# EAGLE schematic 2hz timer (EAGLE 9.6.2)
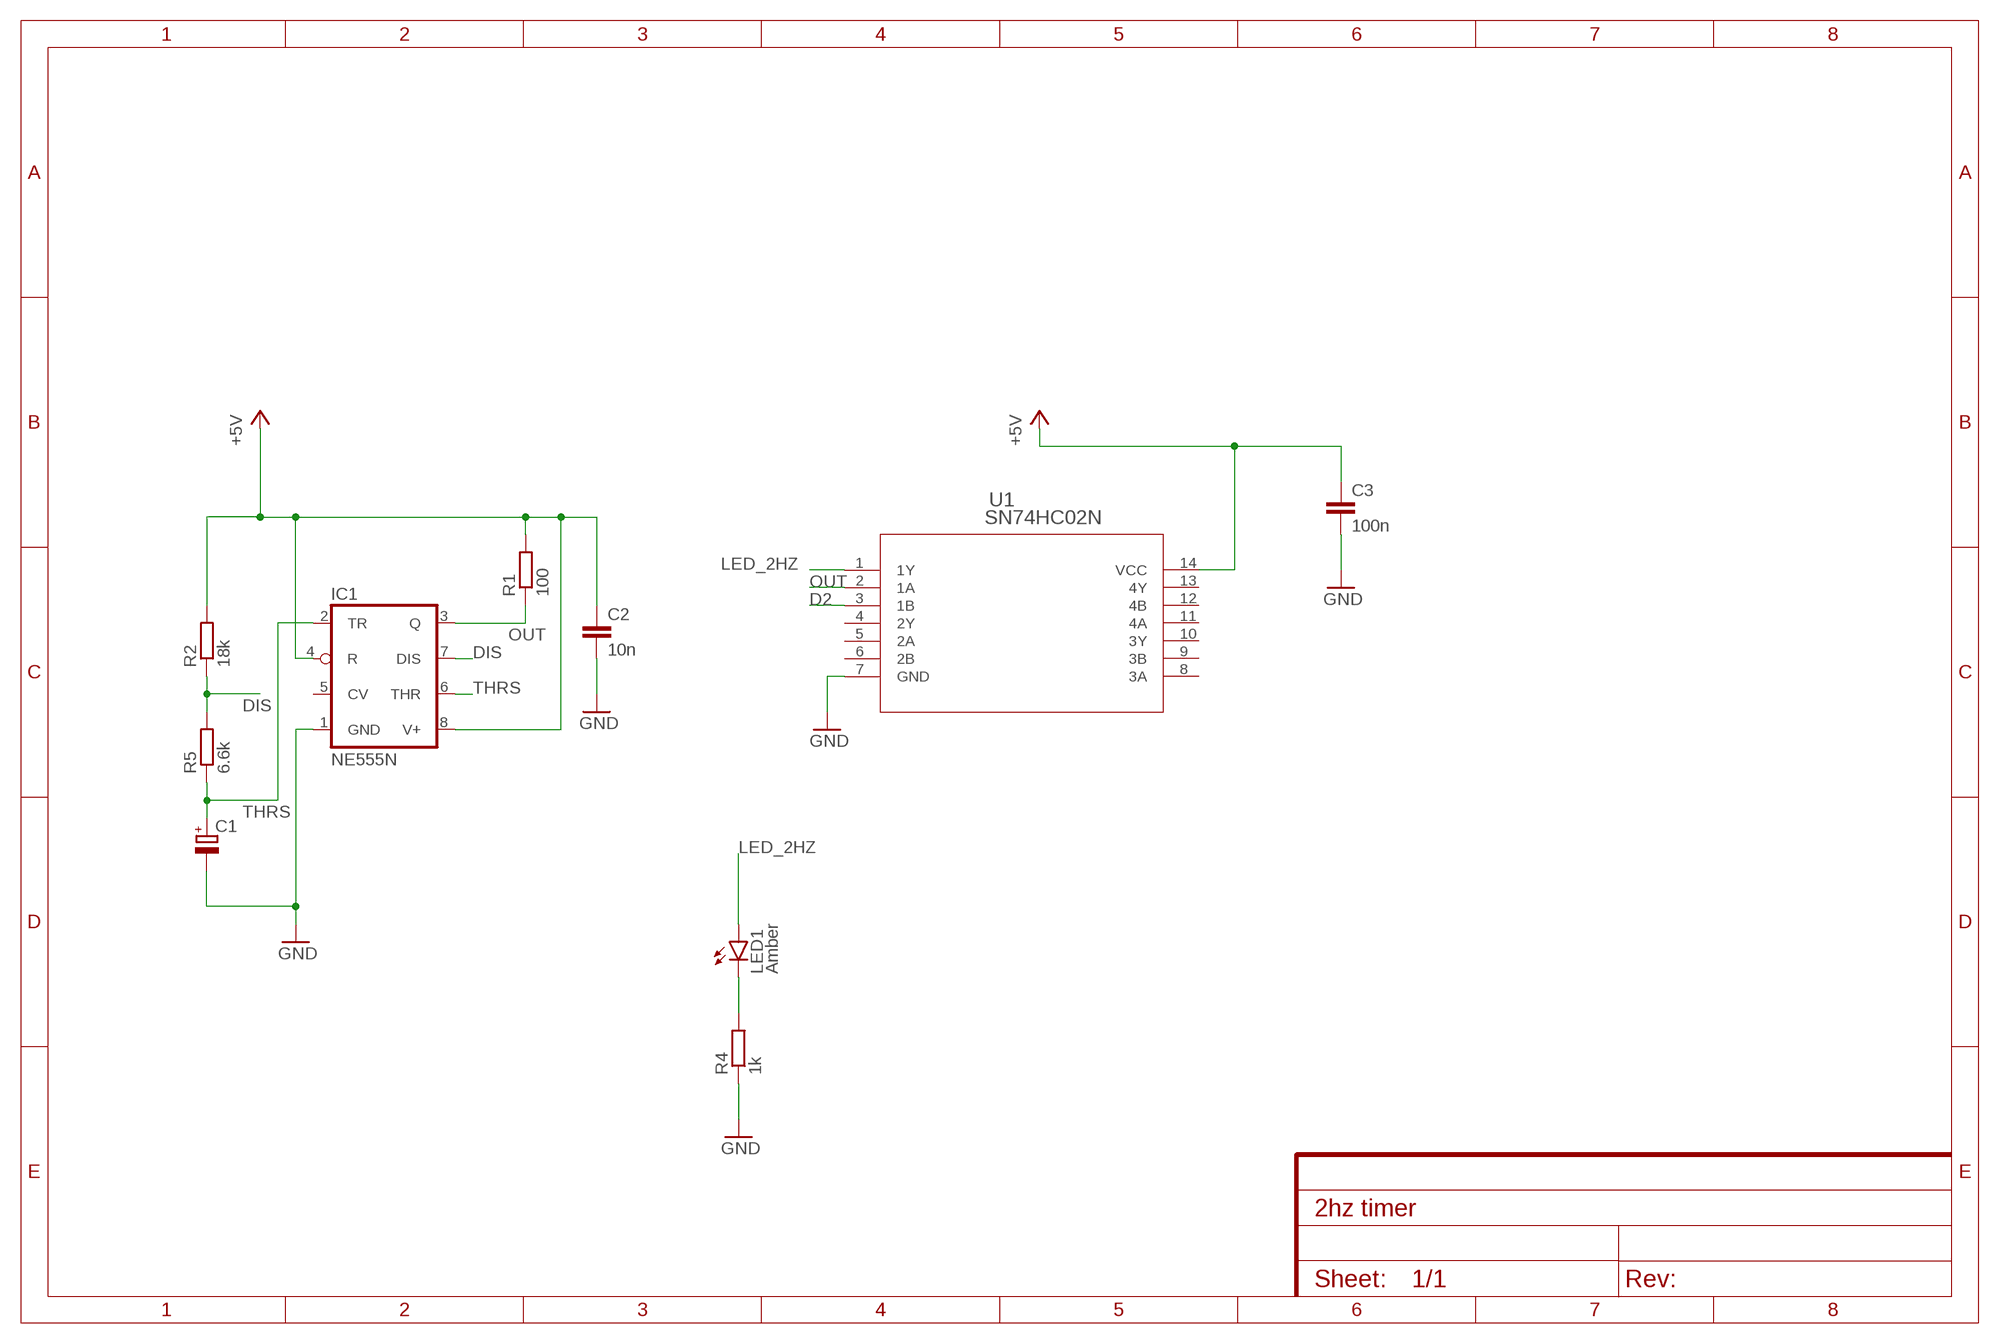
[diagram p0: schematic, sheet 1]

## Parts
C1  CPOL-EUTT2D4  [TT2D4]
C2  10n  C-EU025-024X044  [C025-024X044]
C3  100n  C-EU025-024X044  [C025-024X044]
IC1  NE555N  [DIL08-ROUND]
LED1  Amber  LED_23MM  [LED3MM]
R1  100  R-EU_0204/7  [0204/7]
R2  18k  R-EU_0204/7  [0204/7]
R4  1k  R-EU_0204/7  [0204/7]
R5  6.6k  R-EU_0204/7  [0204/7]
U1  SN74HC02N  [N14]

## Nets
+5V: C2.1 C3.1 IC1.4(R) IC1.8(V+) R1.2 R2.2 U1.14(VCC)
D2: U1.3(1B)
DIS: IC1.7(DIS) R2.1 R5.2
GND: C1.- C2.2 C3.2 IC1.1(GND) R4.1 U1.7(GND)
LED_2HZ: LED1.A U1.1(1Y)
N$3: LED1.K(C) R4.2
OUT: IC1.3(Q) R1.1 U1.2(1A)
THRS: C1.+ IC1.2(TR) IC1.6(THR) R5.1
Unconnected: IC1.5(CV) U1.4(2Y) U1.5(2A) U1.6(2B) U1.8(3A) U1.9(3B) U1.10(3Y) U1.11(4A) U1.12(4B) U1.13(4Y)

## Library data of the parts
C1 = IDP_library:CPOL-EU: POLARIZED CAPACITOR, European symbol; SPICEPREFIX: C
C2 C3 = IDP_library:C-EU: CAPACITOR, European symbol; SPICEPREFIX: C
IC1 = IDP_library:*555: TIMER Changed DIP package to have round (not oval) pin pads http://www.ladyada.net/library/pcb/eaglelibrary.html
LED1 = IDP_library:LED_2: LED
R1 R2 R4 R5 = IDP_library:R-EU_: RESISTOR, European symbol; SPICEPREFIX: R
U1 = IDP_library:SN74HC02N; COPYRIGHT: Copyright (C) 2023 Ultra Librarian. All rights reserved.; MANUFACTURER_PART_NUMBER: SN74HC02N; MFR_NAME: Texas Instruments